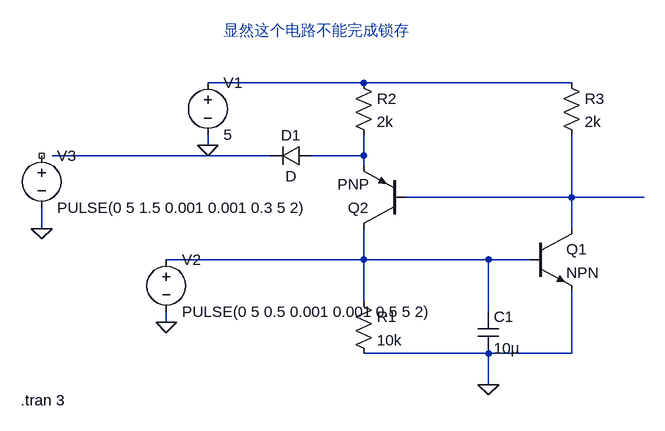
[diagram p0: schematic lock.asc]
lock.asc, the LTspice schematic file:
Version 4.1
SHEET 1 880 680
WIRE 16 -224 -224 -224
WIRE 336 -224 16 -224
WIRE -224 -128 -224 -144
WIRE -128 -112 -464 -112
WIRE 16 -112 16 -144
WIRE 16 -112 -64 -112
WIRE 16 -96 16 -112
WIRE 336 -48 336 -144
WIRE 336 -48 80 -48
WIRE 448 -48 336 -48
WIRE -480 0 -480 -32
WIRE 336 0 336 -48
WIRE 16 48 16 0
WIRE 16 48 -288 48
WIRE 208 48 16 48
WIRE 272 48 208 48
WIRE 16 112 16 48
WIRE 208 128 208 48
WIRE -288 144 -288 128
WIRE 208 192 16 192
WIRE 336 192 336 96
WIRE 336 192 208 192
WIRE 208 240 208 192
FLAG 208 240 0
FLAG -224 -128 0
FLAG -480 0 0
FLAG -288 144 0
SYMBOL cap 192 128 R0
SYMATTR InstName C1
SYMATTR Value 10µ
SYMBOL res 0 96 R0
SYMATTR InstName R1
SYMATTR Value 10k
SYMBOL npn 272 0 R0
SYMATTR InstName Q1
SYMBOL pnp 80 0 R180
SYMATTR InstName Q2
SYMBOL voltage -224 -240 R0
WINDOW 123 0 0 Left 0
WINDOW 39 0 0 Left 0
SYMATTR InstName V1
SYMATTR Value 5
SYMBOL res 0 -240 R0
SYMATTR InstName R2
SYMATTR Value 2k
SYMBOL res 320 -240 R0
SYMATTR InstName R3
SYMATTR Value 2k
SYMBOL diode -64 -128 R90
WINDOW 0 0 32 VBottom 2
WINDOW 3 32 32 VTop 2
SYMATTR InstName D1
SYMBOL voltage -288 32 R0
WINDOW 123 0 0 Left 0
WINDOW 39 0 0 Left 0
SYMATTR InstName V2
SYMATTR Value PULSE(0 5 0.5 0.001 0.001 0.5 5 2)
SYMBOL voltage -480 -128 R0
WINDOW 123 0 0 Left 0
WINDOW 39 0 0 Left 0
SYMATTR InstName V3
SYMATTR Value PULSE(0 5 1.5 0.001 0.001 0.3 5 2)
TEXT -512 264 Left 2 !.tran 3
TEXT -200 -304 Left 2 ;显然这个电路不能完成锁存

The netlist it stands for:
* lock.asc
C1 N005 0 10µ
R1 N005 0 10k
Q1 N004 N005 0 0 NPN
Q2 N005 N004 N003 0 PNP
V1 N001 0 5
R2 N001 N003 2k
R3 N001 N004 2k
D1 N003 N002 D
V2 N005 0 PULSE(0 5 0.5 0.001 0.001 0.5 5 2)
V3 NC_01 0 PULSE(0 5 1.5 0.001 0.001 0.3 5 2)
.model D D
.lib standard.dio
.model NPN NPN
.model PNP PNP
.lib standard.bjt
.tran 3
* 显然这个电路不能完成锁存
.backanno
.end